# Altium schematic sheet 48. TEST AUTOMATION HEADER.SchDoc: TEST AUTOMATION HEADER
size 513 x 386 mm; Project: PROC154E2(001)_SK_AM69; Issue: 1.0; RevCode: E3; Page Create Date: March  8, 1995; Variant Name: Core Design; Schematic Page Number: 48; Page Number: 48; Page Size: C; Comment: MISTRAL_TITLEBLK_CSIZE_1; Page Count: 62; Schematic Page Count: 62; Name: PROC154E2 001 SK AM69; DsnPath: C:\Users\danie\Downloads\sprr466c\PROC154E3_RP\PROC154E3_SCH.DSN; SchematicName: SCHEMATIC1; PageName: 48. TEST AUTOMATION HEADER; PageSize: C; TopSchematic: True
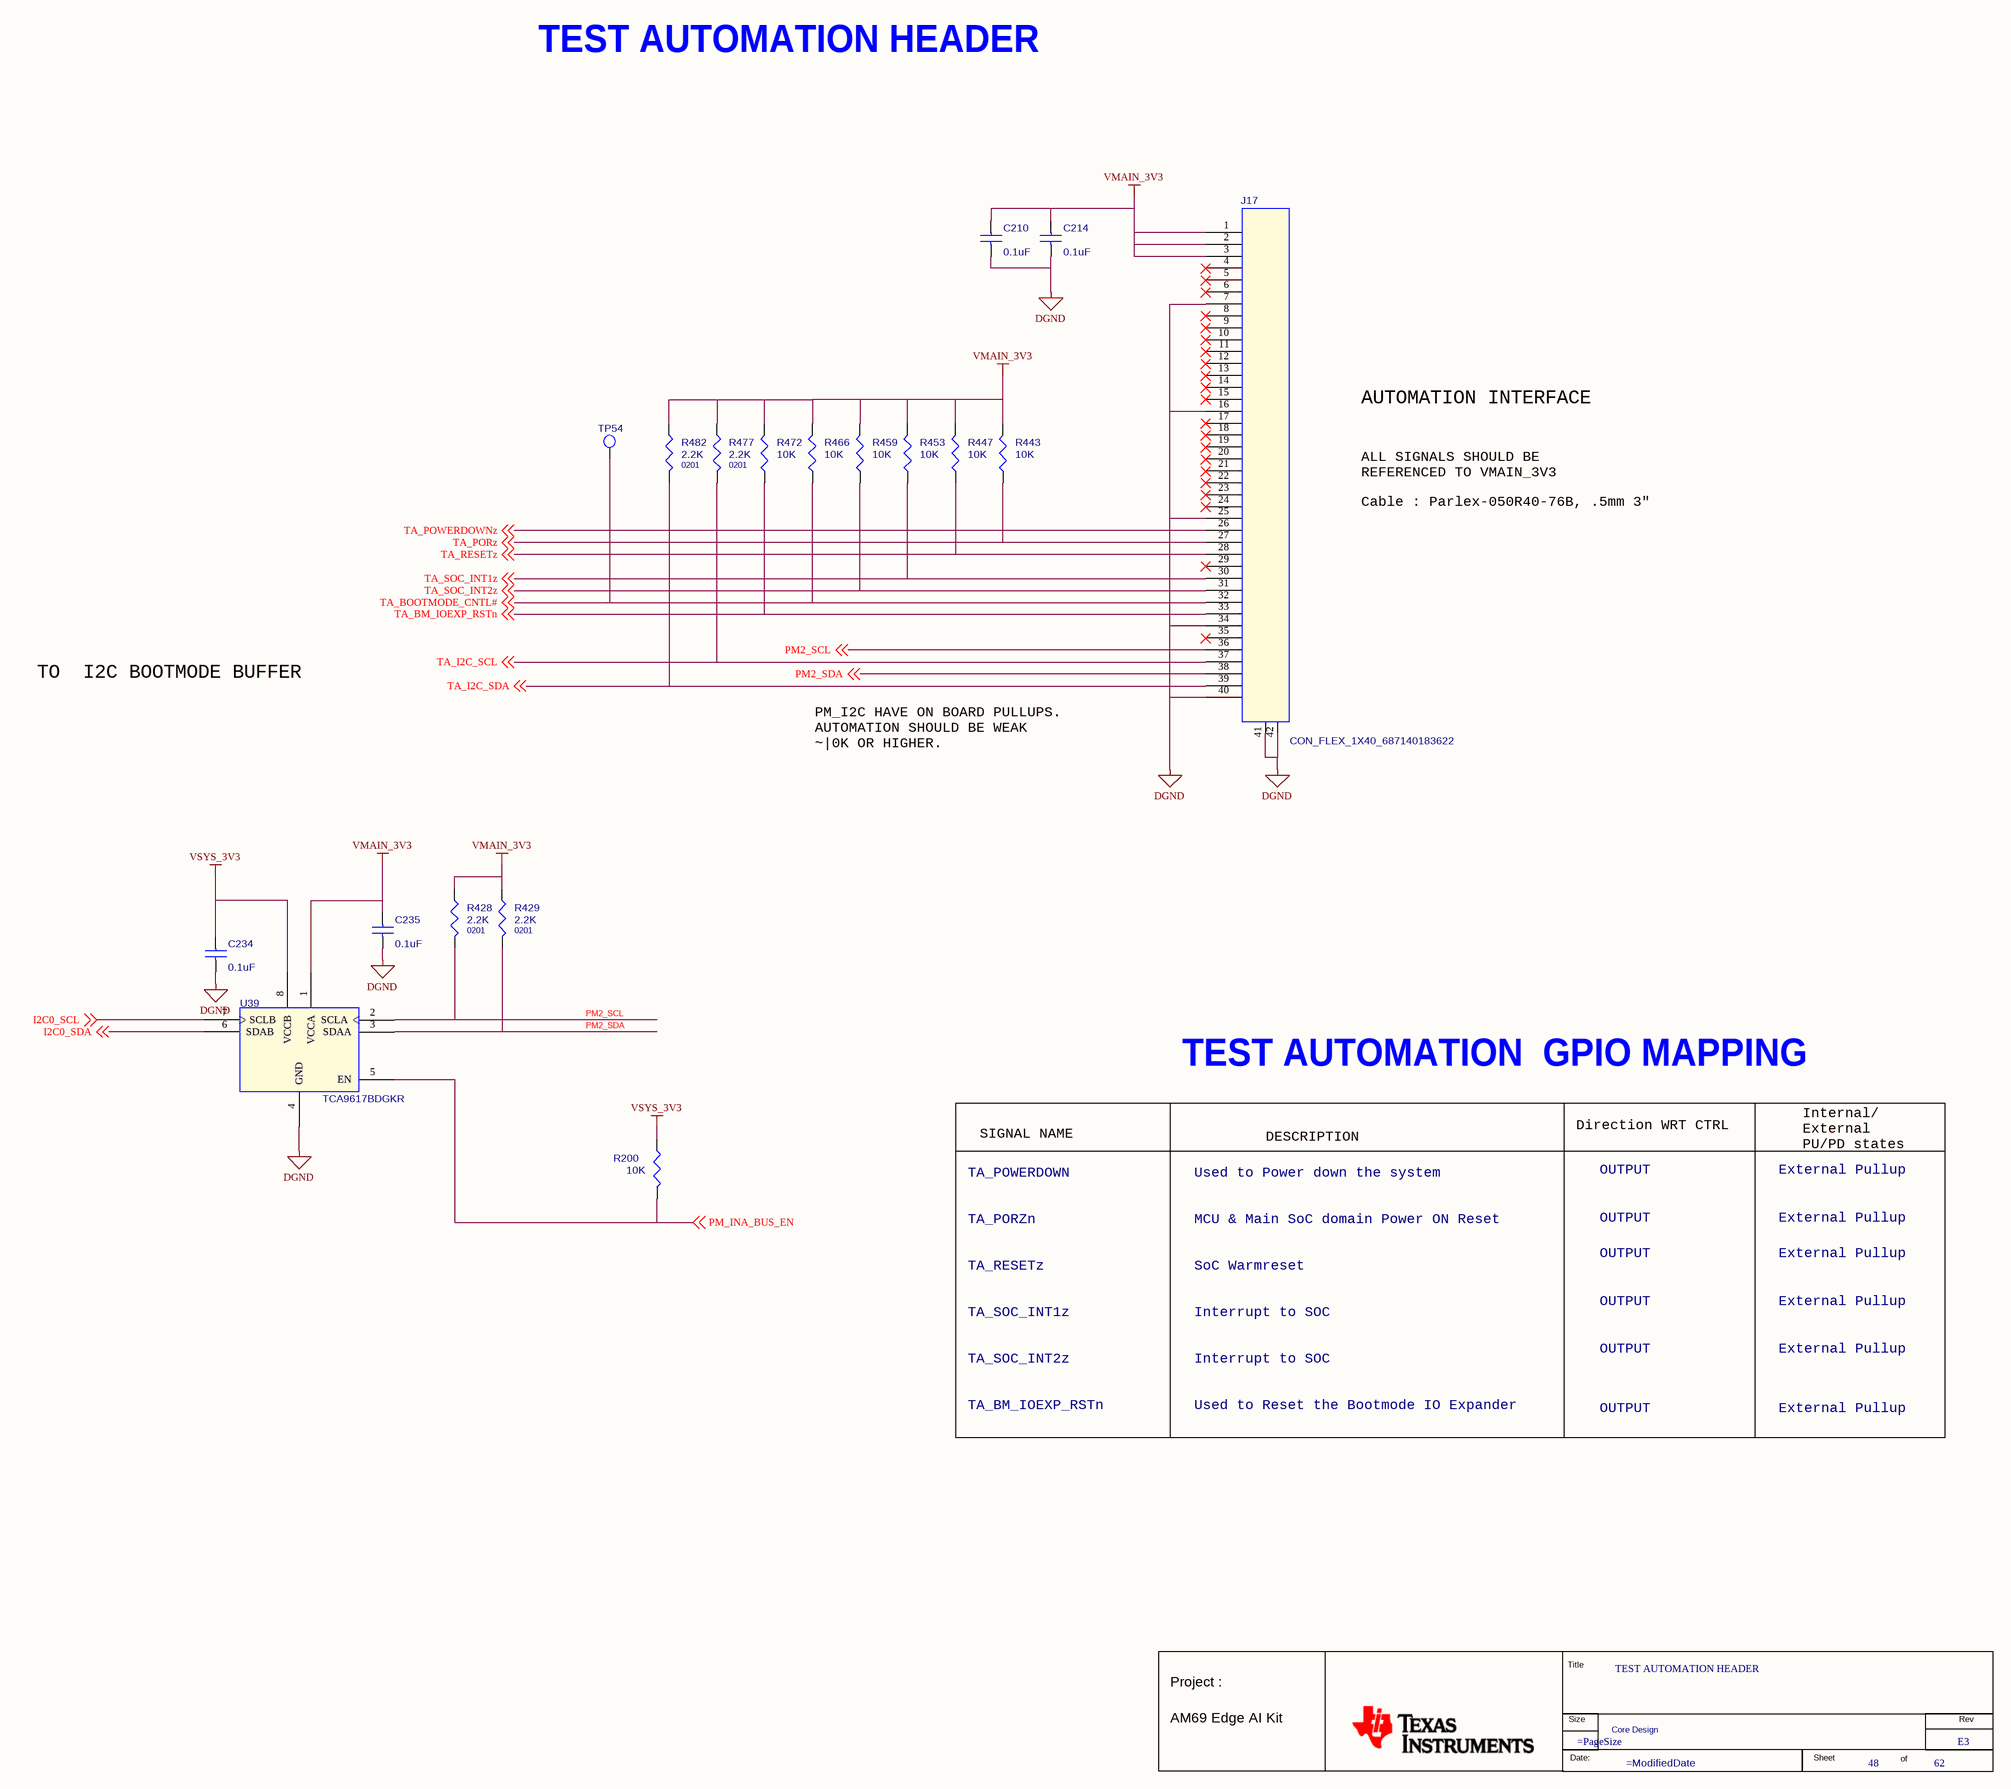
[diagram p0: 48. TEST AUTOMATION HEADER.SchDoc]

## Parts
*  RevCode: E3  Title: TEST AUTOMATION HEADER  Page Number: 48  Page Count: 62  Variant Name: Core Design  (hidden comment: MISTRAL_TITLEBLK_CSIZE_1)  (graphical)
C210  0.1uF  [CAP0201_0-5]
C214  0.1uF  [CAP0201_0-5]
C234  0.1uF  [CAP0201_0-5]
C235  0.1uF  [CAP0201_0-5]
J17  CON_FLEX_1X40_687140183622  [CON_FLEX1X40_687140183622_S_R_S_1-3]
R200  10K  [RES0201_0-5]
R428  2.2K  Package: 0201  [RES0201_0-5]
R429  2.2K  Package: 0201  [RES0201_0-5]
R443  10K  [RES0201_0-5]
R447  10K  [RES0201_0-5]
R453  10K  [RES0201_0-5]
R459  10K  [RES0201_0-5]
R466  10K  [RES0201_0-5]
R472  10K  [RES0201_0-5]
R477  2.2K  Package: 0201  [RES0201_0-5]
R482  2.2K  Package: 0201  [RES0201_0-5]
TP54  TP30_SMD  [TP30_SMD]  (value not drawn)
U39  TCA9617BDGKR  [VSSOP8_25-59_120X120_1-1]

## Nets
DGND: C210.2 C214.2 C234.2 C235.2 J17.7 J17.16 J17.25 J17.34 J17.40 J17.41 J17.42 U39.4(GND)
VMAIN_3V3: C210.1 C214.1 C235.1 J17.1 J17.2 J17.3 R428.1 R429.1 R443.2 R447.2 R453.2 R459.2 R466.2 R472.2 R477.1 R482.1 U39.1(VCCA)
VSYS_3V3: C234.1 R200.2 U39.8(VCCB)
I2C0_SCL: U39.7(SCLB) ; off-sheet I2C0_SCL
I2C0_SDA: U39.6(SDAB) ; off-sheet I2C0_SDA
PM2_SCL: J17.36 R428.2 U39.2(SCLA) ; off-sheet PM2_SCL
PM2_SDA: J17.38 R429.2 U39.3(SDAA) ; off-sheet PM2_SDA
PM_INA_BUS_EN: R200.1 U39.5(EN) ; off-sheet PM_INA_BUS_EN
TA_BM_IOEXP_RSTn: J17.33 R472.1 ; off-sheet TA_BM_IOEXP_RSTn
TA_BOOTMODE_CNTL#: J17.32 R466.1 TP54.1(TP) ; off-sheet TA_BOOTMODE_CNTL#
TA_I2C_SCL: J17.37 R477.2 ; off-sheet TA_I2C_SCL
TA_I2C_SDA: J17.39 R482.2 ; off-sheet TA_I2C_SDA
TA_PORz: J17.27 R443.1 ; off-sheet TA_PORz
TA_POWERDOWNz: J17.26 ; off-sheet TA_POWERDOWNz
TA_RESETz: J17.28 R447.1 ; off-sheet TA_RESETz
TA_SOC_INT1z: J17.30 R453.1 ; off-sheet TA_SOC_INT1z
TA_SOC_INT2z: J17.31 R459.1 ; off-sheet TA_SOC_INT2z

Not connected (* = marked no-connect by the designer): J17 4* 5* 6* 8* 9* 10* 11* 12* 13* 14* 15* 17* 18* 19* 20* 21* 22* 23* 24* 29* 35*

## Notes on the sheet
- TEST AUTOMATION HEADER
- AUTOMATION INTERFACE
- ALL SIGNALS SHOULD BE
  REFERENCED TO VMAIN_3V3
- Cable : Parlex-050R40-76B, .5mm 3"
- TO  I2C BOOTMODE BUFFER
- PM_I2C HAVE ON BOARD PULLUPS.
  AUTOMATION SHOULD BE WEAK
  ~20K OR HIGHER.
- TEST AUTOMATION  GPIO MAPPING
- SIGNAL NAME
- DESCRIPTION
- Direction WRT CTRL
- Internal/
  External
  PU/PD states
- TA_POWERDOWN
  TA_PORZn
  TA_RESETz
  TA_SOC_INT1z
  TA_SOC_INT2z
  TA_BM_IOEXP_RSTn
- Used to Power down the system
  MCU & Main SoC domain Power ON Reset
  SoC Warmreset
  Interrupt to SOC
  Interrupt to SOC
  Used to Reset the Bootmode IO Expander
- OUTPUT
- External Pullup
- (in symbol MISTRAL_TITLEBLK_CSIZE_1) Title; Project :; Size; Rev; AM69 Edge AI Kit; Date:; Sheet; of

## Library data of the parts
* = MISTRAL_TITLEBLK_CSIZE_1: Issue: 1.0; Project: PROC154E2(001)_SK_AM69; Name: PROC154E2 001 SK AM69; Page Create Date: March  8, 1995; Page Size: =PageSize; Page Modify Date: =ModifiedDate; Schematic Page Count: 62; Schematic Page Number: 48
C210 = CAP_Dup1: CAP CERAMIC 0.1uF 16V 10% X7S AUTO 0201; Part Reference: C210; Mistral Part No: 120021030007-R; Mfr_name: MURATA; Mfr_part_number: GRT033C71C104KE01D; Part_type: CAPACITORS\CERAMIC; Project: J7ES_SK_BRD; Wattage: NA; Customs_HS_Code: 85322990; Custom_Duty: 15%; Value: 0.1uF; PCB Footprint: CAP0201_0-5; Tolerance: 10%; Voltage: 16V; Package: 0201; Distributor_name: DIGIKEY; Distributor_part_number: 490-GRT033C71C104KE01DTR-ND; Height: 0.33MM; Weight: 330mg; Temperature: -55°C+125°C; Datasheet: Y:\MIS_DATABASE\DATASHEETS\CAPACITORS\GRT033C71C104KE01.PDF; Crtd /date: ALVY/110321; Chkd/date: MANIRAJA/110321; MECHANICAL 3D STEP FILE: CAP0201_0-5
C214 = CAP_Dup1: CAP CERAMIC 0.1uF 16V 10% X7S AUTO 0201; Part Reference: C214; Mistral Part No: 120021030007-R; Mfr_name: MURATA; Mfr_part_number: GRT033C71C104KE01D; Part_type: CAPACITORS\CERAMIC; Project: J7ES_SK_BRD; Wattage: NA; Customs_HS_Code: 85322990; Custom_Duty: 15%; Value: 0.1uF; PCB Footprint: CAP0201_0-5; Tolerance: 10%; Voltage: 16V; Package: 0201; Distributor_name: DIGIKEY; Distributor_part_number: 490-GRT033C71C104KE01DTR-ND; Height: 0.33MM; Weight: 330mg; Temperature: -55°C+125°C; Datasheet: Y:\MIS_DATABASE\DATASHEETS\CAPACITORS\GRT033C71C104KE01.PDF; Crtd /date: ALVY/110321; Chkd/date: MANIRAJA/110321; MECHANICAL 3D STEP FILE: CAP0201_0-5
C234 = CAP_Dup1: CAP CERAMIC 0.1uF 16V 10% X7S AUTO 0201; Part Reference: C234; Mistral Part No: 120021030007-R; Mfr_name: MURATA; Mfr_part_number: GRT033C71C104KE01D; Part_type: CAPACITORS\CERAMIC; Project: J7ES_SK_BRD; Wattage: NA; Customs_HS_Code: 85322990; Custom_Duty: 15%; Value: 0.1uF; PCB Footprint: CAP0201_0-5; Tolerance: 10%; Voltage: 16V; Package: 0201; Distributor_name: DIGIKEY; Distributor_part_number: 490-GRT033C71C104KE01DTR-ND; Height: 0.33MM; Weight: 330mg; Temperature: -55°C+125°C; Datasheet: Y:\MIS_DATABASE\DATASHEETS\CAPACITORS\GRT033C71C104KE01.PDF; Crtd /date: ALVY/110321; Chkd/date: MANIRAJA/110321; MECHANICAL 3D STEP FILE: CAP0201_0-5
C235 = CAP_Dup1: CAP CERAMIC 0.1uF 16V 10% X7S AUTO 0201; Part Reference: C235; Mistral Part No: 120021030007-R; Mfr_name: MURATA; Mfr_part_number: GRT033C71C104KE01D; Part_type: CAPACITORS\CERAMIC; Project: J7ES_SK_BRD; Wattage: NA; Customs_HS_Code: 85322990; Custom_Duty: 15%; Value: 0.1uF; PCB Footprint: CAP0201_0-5; Tolerance: 10%; Voltage: 16V; Package: 0201; Distributor_name: DIGIKEY; Distributor_part_number: 490-GRT033C71C104KE01DTR-ND; Height: 0.33MM; Weight: 330mg; Temperature: -55°C+125°C; Datasheet: Y:\MIS_DATABASE\DATASHEETS\CAPACITORS\GRT033C71C104KE01.PDF; Crtd /date: ALVY/110321; Chkd/date: MANIRAJA/110321; MECHANICAL 3D STEP FILE: CAP0201_0-5
J17 = CON_FLEX_40X1_20347: CON FPC 1X40 0.50MM PITCH FEMALE RT SMD; Part Reference: J17; Part_type: CONNECTOR\FPC; Mfr_name: WURTH ELEKTRONIK; Mistral Part No: 150020120010-R; Custom_Duty: 24%; Customs_HS_Code: 85369090; Wattage: NA; Project: TI_AM243x LP EVM; Value: CON_FLEX_1X40_687140183622; PCB Footprint: CON_FLEX1X40_687140183622_S_R_S_1-3; Footprint Path: Y:\MIS_DATABASE\Library\ALTIUM_TOOL\PCB_FOOTPRINTS\Altium_Footprint_Lib.PcbLib; Library Path: Y:\MIS_DATABASE\Library\ALTIUM_TOOL\SCHEMATICS_PARTS\MS_CONNECTOR_Library.schlib; MECHANICAL 3D STEP FILE: CON_FLEX1X40_687140183622_S_R_S_1-3; Chkd/date: ALVY/101220; Crtd /date: MANIRAJA/101220; Datasheet: Y:\MIS_DATABASE\DATASHEETS\CONNECTORS\687140183622.PDF; Temperature: -25°C+85°C; Weight: NA; Height: 1.30MM; Library Ref: CON_FLEX_40X1_20347; Distributor_part_number: NA; Distributor_name: NA; Package: SMD; Voltage: NA; Tolerance: NA; Mfr_part_number: 687140183622; Footprint Ref: CON_FLEX1X40_687140183622_S_R_S_1-3
R200 = RESISTOR_Dup2: RES 10K 1/20W 5% 0201; Part Reference: R200; Mistral Part No: 110010070051-R; Mfr_name: YAGEO AMERICA; Mfr_part_number: RC0201JR-0710KL; Part_type: RESISTORS\FIXED; Project: GOLDEN-I LITE; Voltage: NA; Customs_HS_Code: 85332119; Custom_Duty: 15%; Value: 10K; Footprint Path: Y:\MIS_DATABASE\Library\ALTIUM_TOOL\PCB_FOOTPRINTS\Altium_Footprint_Lib.PcbLib; Library Path: Y:\MIS_DATABASE\Library\ALTIUM_TOOL\SCHEMATICS_PARTS\MS_DISCRETE_Library.schlib; Footprint Ref: RES0201_0-5; Library Ref: RESISTOR; Tolerance: 5%; Wattage: 1/20W; Package: 0201; Distributor_name: DIGIKEY; Distributor_part_number: 311-10KNCT-ND; Height: 0.26MM; Weight: 0.17mg; Temperature: -55°C+125°C; Datasheet: Y:\MIS_DATABASE\DATASHEETS\RESISTORS\RCXXXXL-SER_MAR18.PDF; Crtd /date: MANIRAJA/050517; Chkd/date: MANIRAJA/050517; MECHANICAL 3D STEP FILE: RES0201_0-5; PCB Footprint: RES0201_0-5
R428 = RESISTOR_Dup2: RES 2.2K 1/20W 5% 0201; Part Reference: R428; Mistral Part No: 110009030427-R; Mfr_name: YAGEO AMERICA; Mfr_part_number: RC0201JR-072K2L; Part_type: RESISTORS\FIXED; Project: GOLDEN-I LITE; Voltage: NA; Customs_HS_Code: 85332119; Custom_Duty: 15%; Value: 2.2K; PCB Footprint: RES0201_0-5; Tolerance: 5%; Wattage: 1/20W; Distributor_name: DIGIKEY; Distributor_part_number: 311-2.2KNCT-ND; Library Ref: RESISTOR; Height: 0.26MM; Weight: 0.17mg; Temperature: -55°C+125°C; Datasheet: Y:\MIS_DATABASE\DATASHEETS\RESISTORS\RCXXXXL-SER_MAR18.PDF; Crtd /date: MANIRAJA/050517; Chkd/date: MANIRAJA/050517; MECHANICAL 3D STEP FILE: RES0201_0-5; Footprint Ref: RES0201_0-5; Library Path: Y:\MIS_DATABASE\Library\ALTIUM_TOOL\SCHEMATICS_PARTS\MS_DISCRETE_Library.schlib; Footprint Path: Y:\MIS_DATABASE\Library\ALTIUM_TOOL\PCB_FOOTPRINTS\Altium_Footprint_Lib.PcbLib
R429 = RESISTOR_Dup2: RES 2.2K 1/20W 5% 0201; Part Reference: R429; Mistral Part No: 110009030427-R; Mfr_name: YAGEO AMERICA; Mfr_part_number: RC0201JR-072K2L; Part_type: RESISTORS\FIXED; Project: GOLDEN-I LITE; Voltage: NA; Customs_HS_Code: 85332119; Custom_Duty: 15%; Value: 2.2K; PCB Footprint: RES0201_0-5; Tolerance: 5%; Wattage: 1/20W; Distributor_name: DIGIKEY; Distributor_part_number: 311-2.2KNCT-ND; Library Ref: RESISTOR; Height: 0.26MM; Weight: 0.17mg; Temperature: -55°C+125°C; Datasheet: Y:\MIS_DATABASE\DATASHEETS\RESISTORS\RCXXXXL-SER_MAR18.PDF; Crtd /date: MANIRAJA/050517; Chkd/date: MANIRAJA/050517; MECHANICAL 3D STEP FILE: RES0201_0-5; Footprint Ref: RES0201_0-5; Library Path: Y:\MIS_DATABASE\Library\ALTIUM_TOOL\SCHEMATICS_PARTS\MS_DISCRETE_Library.schlib; Footprint Path: Y:\MIS_DATABASE\Library\ALTIUM_TOOL\PCB_FOOTPRINTS\Altium_Footprint_Lib.PcbLib
R443 = RESISTOR_Dup2: RES 10K 1/20W 5% 0201; Part Reference: R443; Part_type: RESISTORS\FIXED; Mfr_part_number: RC0201JR-0710KL; Mfr_name: YAGEO AMERICA; Mistral Part No: 110010070051-R; Custom_Duty: 15%; Customs_HS_Code: 85332119; Voltage: NA; Project: GOLDEN-I LITE; Value: 10K; PCB Footprint: RES0201_0-5; MECHANICAL 3D STEP FILE: RES0201_0-5; Chkd/date: MANIRAJA/050517; Crtd /date: MANIRAJA/050517; Datasheet: Y:\MIS_DATABASE\DATASHEETS\RESISTORS\RCXXXXL-SER_MAR18.PDF; Temperature: -55°C+125°C; Weight: 0.17mg; Height: 0.26MM; Distributor_part_number: 311-10KNCT-ND; Distributor_name: DIGIKEY; Package: 0201; Wattage: 1/20W; Tolerance: 5%; Library Ref: RESISTOR; Footprint Ref: RES0201_0-5; Library Path: Y:\MIS_DATABASE\Library\ALTIUM_TOOL\SCHEMATICS_PARTS\MS_DISCRETE_Library.schlib; Footprint Path: Y:\MIS_DATABASE\Library\ALTIUM_TOOL\PCB_FOOTPRINTS\Altium_Footprint_Lib.PcbLib
R447 = RESISTOR_Dup2: RES 10K 1/20W 5% 0201; Part Reference: R447; Part_type: RESISTORS\FIXED; Mfr_part_number: RC0201JR-0710KL; Mfr_name: YAGEO AMERICA; Mistral Part No: 110010070051-R; Custom_Duty: 15%; Customs_HS_Code: 85332119; Voltage: NA; Project: GOLDEN-I LITE; Value: 10K; PCB Footprint: RES0201_0-5; MECHANICAL 3D STEP FILE: RES0201_0-5; Chkd/date: MANIRAJA/050517; Crtd /date: MANIRAJA/050517; Datasheet: Y:\MIS_DATABASE\DATASHEETS\RESISTORS\RCXXXXL-SER_MAR18.PDF; Temperature: -55°C+125°C; Weight: 0.17mg; Height: 0.26MM; Distributor_part_number: 311-10KNCT-ND; Distributor_name: DIGIKEY; Package: 0201; Wattage: 1/20W; Tolerance: 5%; Library Ref: RESISTOR; Footprint Ref: RES0201_0-5; Library Path: Y:\MIS_DATABASE\Library\ALTIUM_TOOL\SCHEMATICS_PARTS\MS_DISCRETE_Library.schlib; Footprint Path: Y:\MIS_DATABASE\Library\ALTIUM_TOOL\PCB_FOOTPRINTS\Altium_Footprint_Lib.PcbLib
R453 = RESISTOR_Dup2: RES 10K 1/20W 5% 0201; Part Reference: R453; Part_type: RESISTORS\FIXED; Mfr_part_number: RC0201JR-0710KL; Mfr_name: YAGEO AMERICA; Mistral Part No: 110010070051-R; Custom_Duty: 15%; Customs_HS_Code: 85332119; Voltage: NA; Project: GOLDEN-I LITE; Value: 10K; PCB Footprint: RES0201_0-5; MECHANICAL 3D STEP FILE: RES0201_0-5; Chkd/date: MANIRAJA/050517; Crtd /date: MANIRAJA/050517; Datasheet: Y:\MIS_DATABASE\DATASHEETS\RESISTORS\RCXXXXL-SER_MAR18.PDF; Temperature: -55°C+125°C; Weight: 0.17mg; Height: 0.26MM; Distributor_part_number: 311-10KNCT-ND; Distributor_name: DIGIKEY; Package: 0201; Wattage: 1/20W; Tolerance: 5%; Library Ref: RESISTOR; Footprint Ref: RES0201_0-5; Library Path: Y:\MIS_DATABASE\Library\ALTIUM_TOOL\SCHEMATICS_PARTS\MS_DISCRETE_Library.schlib; Footprint Path: Y:\MIS_DATABASE\Library\ALTIUM_TOOL\PCB_FOOTPRINTS\Altium_Footprint_Lib.PcbLib
R459 = RESISTOR_Dup2: RES 10K 1/20W 5% 0201; Part Reference: R459; Part_type: RESISTORS\FIXED; Mfr_part_number: RC0201JR-0710KL; Mfr_name: YAGEO AMERICA; Mistral Part No: 110010070051-R; Custom_Duty: 15%; Customs_HS_Code: 85332119; Voltage: NA; Project: GOLDEN-I LITE; Value: 10K; PCB Footprint: RES0201_0-5; MECHANICAL 3D STEP FILE: RES0201_0-5; Chkd/date: MANIRAJA/050517; Crtd /date: MANIRAJA/050517; Datasheet: Y:\MIS_DATABASE\DATASHEETS\RESISTORS\RCXXXXL-SER_MAR18.PDF; Temperature: -55°C+125°C; Weight: 0.17mg; Height: 0.26MM; Distributor_part_number: 311-10KNCT-ND; Distributor_name: DIGIKEY; Package: 0201; Wattage: 1/20W; Tolerance: 5%; Library Ref: RESISTOR; Footprint Ref: RES0201_0-5; Library Path: Y:\MIS_DATABASE\Library\ALTIUM_TOOL\SCHEMATICS_PARTS\MS_DISCRETE_Library.schlib; Footprint Path: Y:\MIS_DATABASE\Library\ALTIUM_TOOL\PCB_FOOTPRINTS\Altium_Footprint_Lib.PcbLib
R466 = RESISTOR_Dup2: RES 10K 1/20W 5% 0201; Part Reference: R466; Part_type: RESISTORS\FIXED; Mfr_part_number: RC0201JR-0710KL; Mfr_name: YAGEO AMERICA; Mistral Part No: 110010070051-R; Custom_Duty: 15%; Customs_HS_Code: 85332119; Voltage: NA; Project: GOLDEN-I LITE; Value: 10K; PCB Footprint: RES0201_0-5; MECHANICAL 3D STEP FILE: RES0201_0-5; Chkd/date: MANIRAJA/050517; Crtd /date: MANIRAJA/050517; Datasheet: Y:\MIS_DATABASE\DATASHEETS\RESISTORS\RCXXXXL-SER_MAR18.PDF; Temperature: -55°C+125°C; Weight: 0.17mg; Height: 0.26MM; Distributor_part_number: 311-10KNCT-ND; Distributor_name: DIGIKEY; Package: 0201; Wattage: 1/20W; Tolerance: 5%; Library Ref: RESISTOR; Footprint Ref: RES0201_0-5; Library Path: Y:\MIS_DATABASE\Library\ALTIUM_TOOL\SCHEMATICS_PARTS\MS_DISCRETE_Library.schlib; Footprint Path: Y:\MIS_DATABASE\Library\ALTIUM_TOOL\PCB_FOOTPRINTS\Altium_Footprint_Lib.PcbLib
R472 = RESISTOR_Dup2: RES 10K 1/20W 5% 0201; Part Reference: R472; Mistral Part No: 110010070051-R; Mfr_name: YAGEO AMERICA; Mfr_part_number: RC0201JR-0710KL; Part_type: RESISTORS\FIXED; Project: GOLDEN-I LITE; Voltage: NA; Customs_HS_Code: 85332119; Custom_Duty: 15%; Value: 10K; PCB Footprint: RES0201_0-5; Footprint Path: Y:\MIS_DATABASE\Library\ALTIUM_TOOL\PCB_FOOTPRINTS\Altium_Footprint_Lib.PcbLib; Library Path: Y:\MIS_DATABASE\Library\ALTIUM_TOOL\SCHEMATICS_PARTS\MS_DISCRETE_Library.schlib; Footprint Ref: RES0201_0-5; Library Ref: RESISTOR; Tolerance: 5%; Wattage: 1/20W; Package: 0201; Distributor_name: DIGIKEY; Distributor_part_number: 311-10KNCT-ND; Height: 0.26MM; Weight: 0.17mg; Temperature: -55°C+125°C; Datasheet: Y:\MIS_DATABASE\DATASHEETS\RESISTORS\RCXXXXL-SER_MAR18.PDF; Crtd /date: MANIRAJA/050517; Chkd/date: MANIRAJA/050517; MECHANICAL 3D STEP FILE: RES0201_0-5
R477 = RESISTOR_Dup2: RES 2.2K 1/20W 5% 0201; Part Reference: R477; Part_type: RESISTORS\FIXED; Mfr_part_number: RC0201JR-072K2L; Mfr_name: YAGEO AMERICA; Mistral Part No: 110009030427-R; Custom_Duty: 15%; Customs_HS_Code: 85332119; Voltage: NA; Project: GOLDEN-I LITE; Value: 2.2K; PCB Footprint: RES0201_0-5; Footprint Path: Y:\MIS_DATABASE\Library\ALTIUM_TOOL\PCB_FOOTPRINTS\Altium_Footprint_Lib.PcbLib; Library Path: Y:\MIS_DATABASE\Library\ALTIUM_TOOL\SCHEMATICS_PARTS\MS_DISCRETE_Library.schlib; Footprint Ref: RES0201_0-5; MECHANICAL 3D STEP FILE: RES0201_0-5; Chkd/date: MANIRAJA/050517; Crtd /date: MANIRAJA/050517; Datasheet: Y:\MIS_DATABASE\DATASHEETS\RESISTORS\RCXXXXL-SER_MAR18.PDF; Temperature: -55°C+125°C; Weight: 0.17mg; Height: 0.26MM; Library Ref: RESISTOR; Distributor_part_number: 311-2.2KNCT-ND; Distributor_name: DIGIKEY; Wattage: 1/20W; Tolerance: 5%
R482 = RESISTOR_Dup2: RES 2.2K 1/20W 5% 0201; Part Reference: R482; Part_type: RESISTORS\FIXED; Mfr_part_number: RC0201JR-072K2L; Mfr_name: YAGEO AMERICA; Mistral Part No: 110009030427-R; Custom_Duty: 15%; Customs_HS_Code: 85332119; Voltage: NA; Project: GOLDEN-I LITE; Value: 2.2K; PCB Footprint: RES0201_0-5; Footprint Path: Y:\MIS_DATABASE\Library\ALTIUM_TOOL\PCB_FOOTPRINTS\Altium_Footprint_Lib.PcbLib; Library Path: Y:\MIS_DATABASE\Library\ALTIUM_TOOL\SCHEMATICS_PARTS\MS_DISCRETE_Library.schlib; Footprint Ref: RES0201_0-5; MECHANICAL 3D STEP FILE: RES0201_0-5; Chkd/date: MANIRAJA/050517; Crtd /date: MANIRAJA/050517; Datasheet: Y:\MIS_DATABASE\DATASHEETS\RESISTORS\RCXXXXL-SER_MAR18.PDF; Temperature: -55°C+125°C; Weight: 0.17mg; Height: 0.26MM; Library Ref: RESISTOR; Distributor_part_number: 311-2.2KNCT-ND; Distributor_name: DIGIKEY; Wattage: 1/20W; Tolerance: 5%
TP54 = TESTPOINT_Dup1: TESTPOINT CIR 30 SMD; Part Reference: TP54; Mistral Part No: 130009030930; Mfr_name: LOCAL; Custom_Duty: NA; Project: BT MODULE_CSRBC04; Value: TP30_SMD; Customs_HS_Code: NA; Mfr_part_number: TP30_SMD; Part_type: TESTPOINT; Package: SMD; Distributor_name: NA; Distributor_part_number: NA; Height: NA; Crtd /date: MAZHAR/171006; Chkd/date: SHREESHAIL/171006; Tolerance: NA; Voltage: NA; Wattage: NA; Weight: NA; Temperature: NA; Datasheet: NA; MECHANICAL 3D STEP FILE: NA; Library Path: Y:\MIS_DATABASE\Library\ALTIUM_TOOL\SCHEMATICS_PARTS\MS_DISCRETE_Library.schlib; Footprint Path: Y:\MIS_DATABASE\Library\ALTIUM_TOOL\PCB_FOOTPRINTS\Altium_Footprint_Lib.PcbLib; Library Ref: TESTPOINT; Footprint Ref: TP30_SMD; RoHS: NA; PCB Footprint: TP30_SMD
U39 = TCA9617BDGKR_VSSOP8: IC FM+I2C BUS REPEATER LEVEL TRANSLATOR VSSOP8; Part Reference: U39; Part_type: ICS\INTERFACE\LEVEL TRANSLATOR; Mfr_name: TEXAS INSTRUMENTS; Mistral Part No: 141017100010-R; Custom_Duty: 15%; Customs_HS_Code: 85423100; Wattage: NA; Project: TI_MAXIE_CPB; Value: TCA9617BDGKR; MECHANICAL 3D STEP FILE: VSSOP8_25-59_120X120_1-1; Chkd/date: MANIRAJA/131017; Crtd /date: MANIRAJA/131017; Datasheet: Y:\MIS_DATABASE\DATASHEETS\ICS\INTERFACE\TCA9617B.PDF; Temperature: -40°C+85°C; Weight: NA; Height: 1.10MM; Library Ref: TCA9617BDGKR_VSSOP8; Distributor_part_number: 296-40579-1-ND; Distributor_name: DIGIKEY; Package: VSSOP8; Voltage: NA; Tolerance: NA; Mfr_part_number: TCA9617BDGKR; PCB Footprint: VSSOP8_25-59_120X120_1-1